# Altium schematic sheet SwitchPower220VAC.SchDoc
size A0
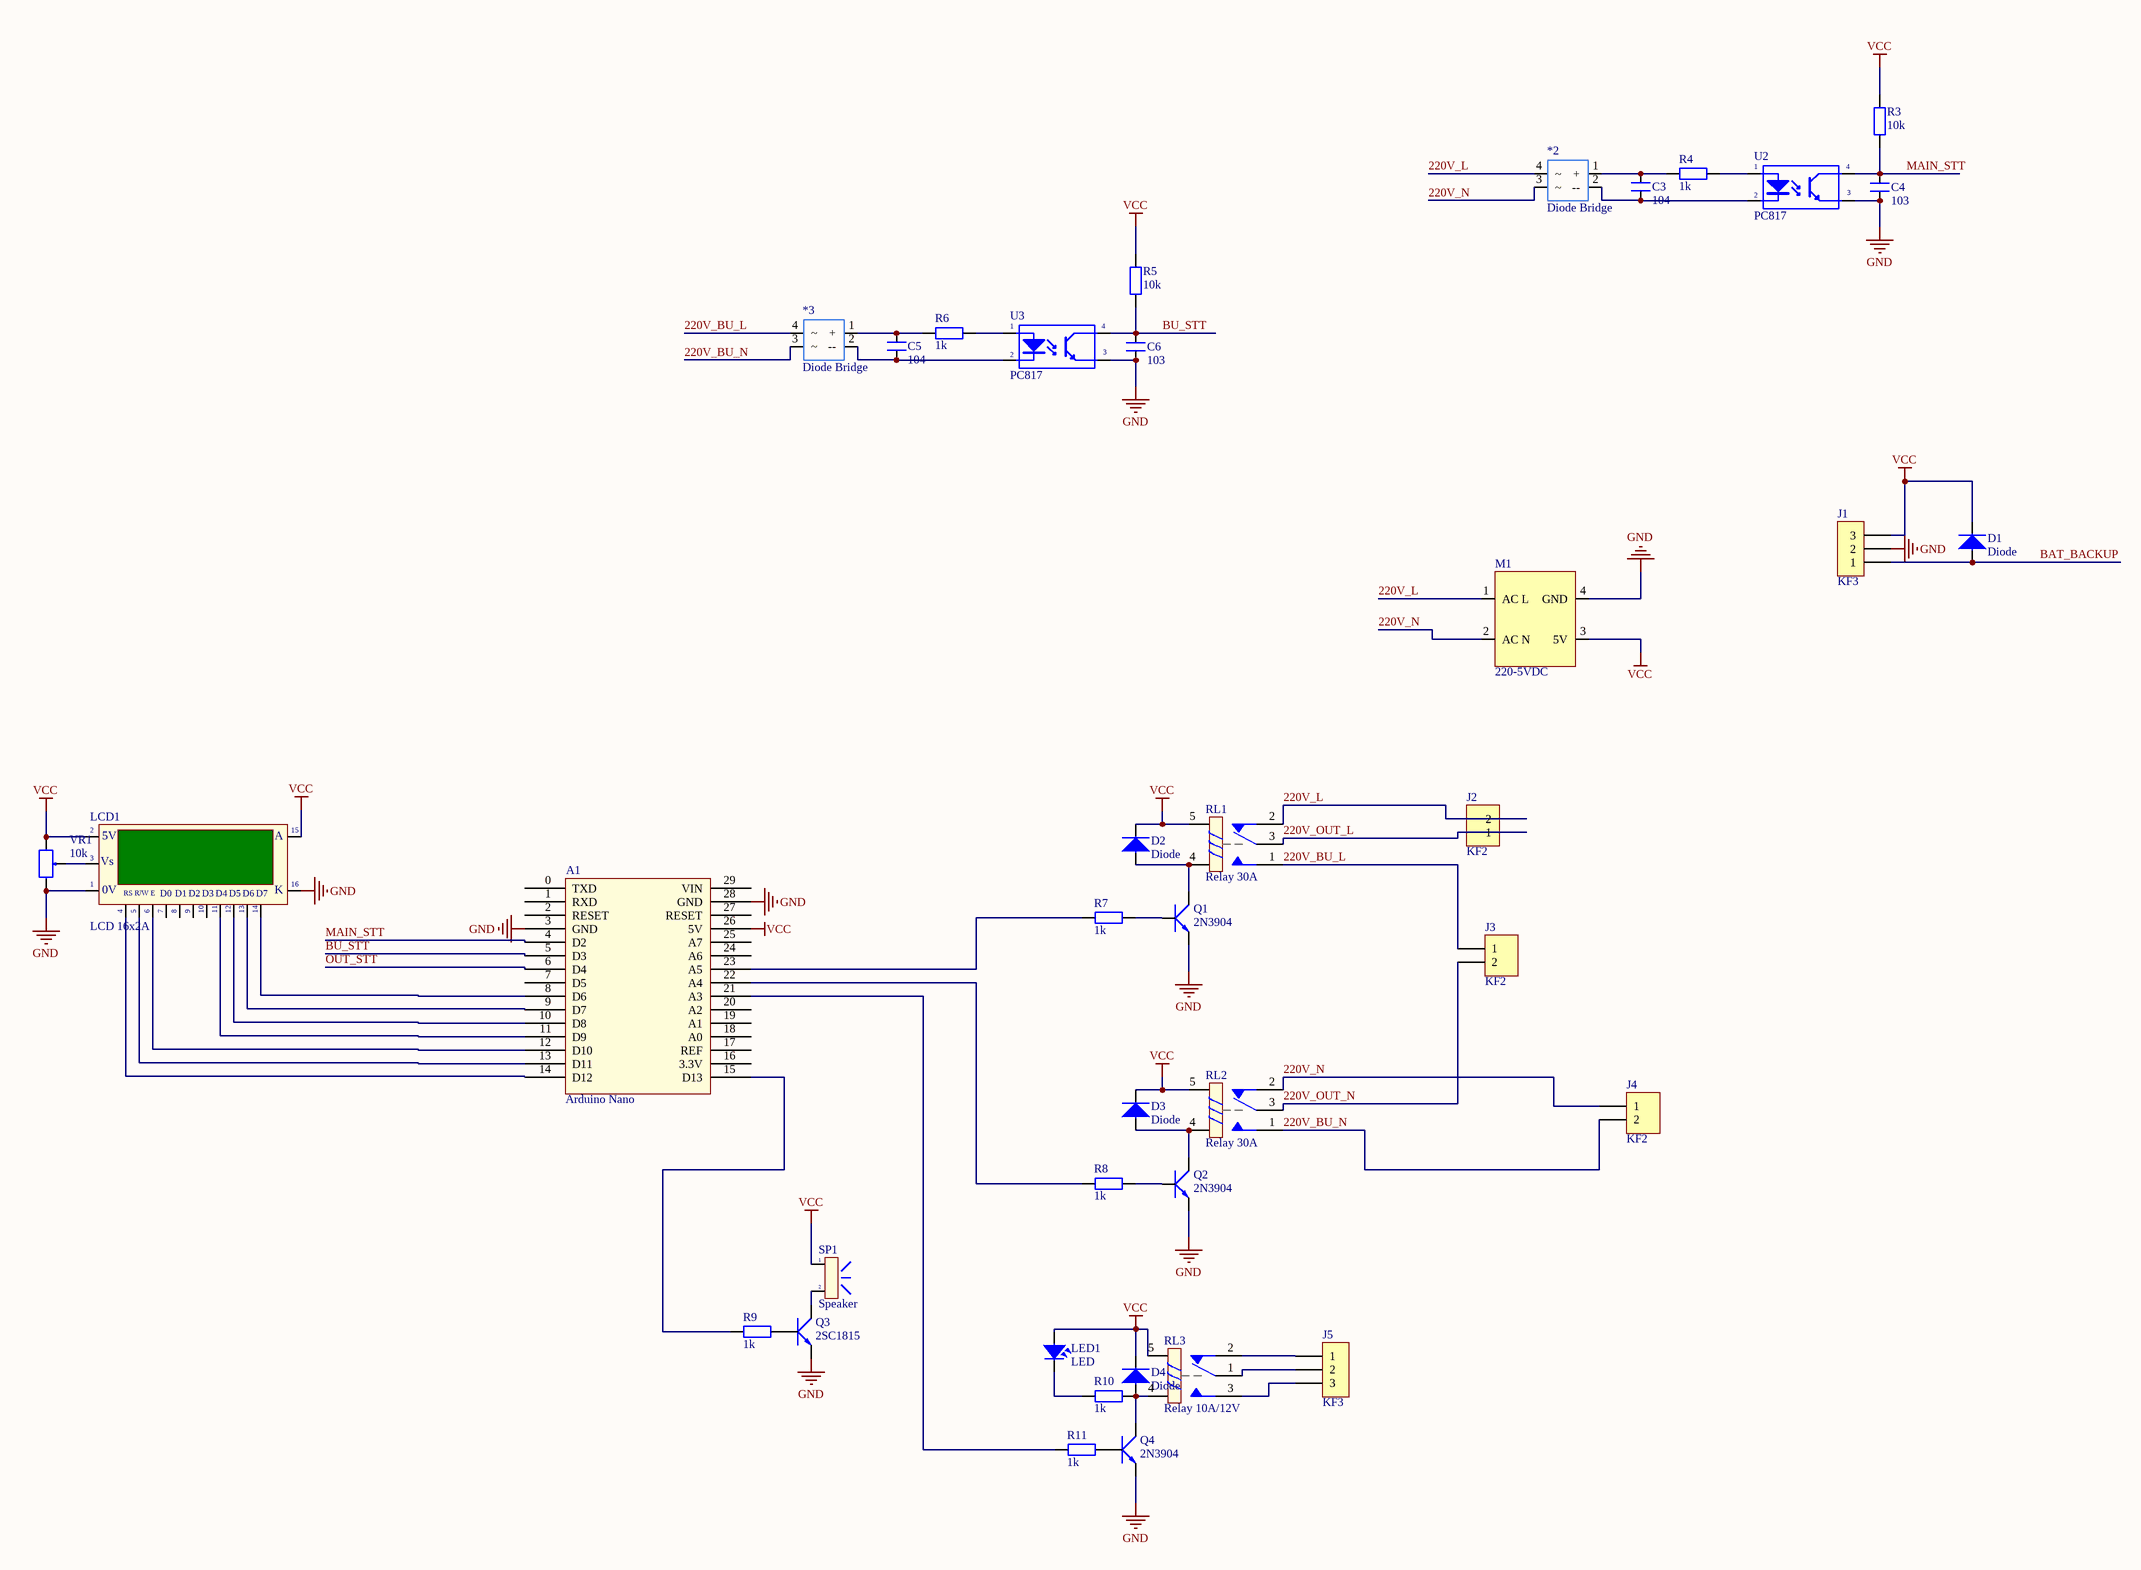
[diagram p0: SwitchPower220VAC.SchDoc]

## Parts
*2  Diode Bridge  [Diode Bridge 1A]
*3  Diode Bridge  [Diode Bridge 1A]
A1  Arduino Nano  [Arduino Nano]
C3  104  [CN2]
C4  103  [SM-0805]
C5  104  [CN2]
C6  103  [SM-0805]
D1  Diode  [DIO-SMD-106]
D2  Diode  [DIO-SMD-106]
D3  Diode  [DIO-SMD-106]
D4  Diode  [DIO-SMD-106]
J1  KF3  [KF3-5.08]
J2  KF2  [KF2-7.62]
J3  KF2  [KF2-7.62]
J4  KF2  [KF2-7.62]
J5  KF3  [KF3-5.08]
LCD1  LCD 16x2A  [LCD16X2]
LED1  LED  [LED-5-Green]
M1  220-5VDC  [5V 700mA 3.5W AC DC]
Q1  2N3904  [TO92-123]
Q2  2N3904  [TO92-123]
Q3  2SC1815  [TO92-123]
Q4  2N3904  [TO92-123]
R3  10k  [RES-SMD-0805]
R4  1k  [RES-SMD-0805]
R5  10k  [RES-SMD-0805]
R6  1k  [RES-SMD-0805]
R7  1k  [RES-SMD-0805]
R8  1k  [RES-SMD-0805]
R9  1k  [RES-SMD-0805]
R10  1k  [RES-SMD-0805]
R11  1k  [RES-SMD-0805]
RL1  Relay 30A  [RELAY 30A]
RL2  Relay 30A  [RELAY 30A]
RL3  Relay 10A/12V  [RL_SPDT_10A]
SP1  Speaker  [SPK]
U2  PC817  [DIP4]
U3  PC817  [DIP4]
VR1  10k  [VR-S2]

## Nets
GND: A1.3(GND) A1.28(GND) C4.1 C6.1 J1.2 LCD1.1(GND) LCD1.16(K) M1.4(GND) Q1.1(E) Q2.1(E) Q3.1(E) Q4.1(E) U2.3(E) U3.3(E) VR1.3
VCC: A1.26(5V) D1.2 D2.2 D3.2 D4.2 J1.3 LCD1.2(VDD) LCD1.15(A) LED1.1 M1.3(5V) R3.2 R5.2 RL1.5 RL2.5 RL3.5 SP1.1 VR1.1
220V_BU_L: *3.4 J3.1 RL1.1
220V_BU_N: *3.3 J4.2 RL2.1
220V_L: *2.4 J2.2 M1.1(AC_L) RL1.2
220V_N: *2.3 J4.1 M1.2(AC_N) RL2.2
220V_OUT_L: J2.1 RL1.3
220V_OUT_N: J3.2 RL2.3
BAT_BACKUP: D1.1 J1.1
BU_STT: A1.5(D3) C6.2 R5.1 U3.4(C)
MAIN_STT: A1.4(D2) C4.2 R3.1 U2.4(C)
OUT_STT: A1.6(D4)
Net*2_1: *2.1(+) C3.2 R4.1
Net*2_2: *2.2(--) C3.1 U2.2(K)
Net*3_1: *3.1(+) C5.2 R6.1
Net*3_2: *3.2(--) C5.1 U3.2(K)
NetA1_8: A1.8(D6) LCD1.14(D7)
NetA1_9: A1.9(D7) LCD1.13(D6)
NetA1_10: A1.10(D8) LCD1.12(D5)
NetA1_11: A1.11(D9) LCD1.11(D4)
NetA1_12: A1.12(D10) LCD1.6(~{EN})
NetA1_13: A1.13(D11) LCD1.5(R/~{W})
NetA1_14: A1.14(D12) LCD1.4(RS)
NetA1_15: A1.15(D13) R9.1
NetA1_21: A1.21(A3) R11.1
NetA1_22: A1.22(A4) R8.1
NetA1_23: A1.23(A5) R7.1
NetD2_1: D2.1 Q1.3(C) RL1.4
NetD3_1: D3.1 Q2.3(C) RL2.4
NetD4_1: D4.1 Q4.3(C) R10.2 RL3.4
NetJ5_1: J5.1 RL3.2
NetJ5_2: J5.2 RL3.1
NetJ5_3: J5.3 RL3.3
NetLCD1_3: LCD1.3(VEE) VR1.2
NetLED1_2: LED1.2 R10.1
NetQ1_2: Q1.2(B) R7.2
NetQ2_2: Q2.2(B) R8.2
NetQ3_2: Q3.2(C) SP1.2
NetQ3_3: Q3.3(B) R9.2
NetQ4_2: Q4.2(B) R11.2
NetR4_2: R4.2 U2.1(A)
NetR6_2: R6.2 U3.1(A)

Not connected (* = marked no-connect by the designer): A1 0(TXD) 1(RXD) 2(RESET) 7(D5) 16(3.3V) 17(REF) 18(A0) 19(A1) 20(A2) 24(A6) 25(A7) 27(RESET) 29(VIN); LCD1 7(D0) 8(D1) 9(D2) 10(D3)

## Notes on the sheet
- (in symbol LCD16x2A) 5V; Vs; |; 0V; R/W; E

## Library data of the parts
C3 C5 = CN2: Cap np 104 => 105pF; Value: 0.1uF
C4 C6 = CM: Cap SMD; Value: 103
J1 J5 = KF3: Manufacturer: Würth Elektronik eiSos GmbH; partNo: 691103110003; ComponentLink1 Description: Manufacturer; ComponentLink2 Description: Datasheet; NoPins: 3; Created Date: 29 October 2013; ComponentLink1URL: http://www.we-online.com; ComponentLink2URL: http://katalog.we-online.de/em/datasheet/6911031100xx.pdf; Created by: Karrer Zheng
J2-J4 = KF2: Manufacturer: Würth Elektronik eiSos GmbH; partNo: 691103110002; ComponentLink1 Description: Manufacturer; ComponentLink2 Description: Datasheet; NoPins: 2; Created Date: 29 October 2013; ComponentLink1URL: http://www.we-online.com; ComponentLink2URL: http://katalog.we-online.de/em/datasheet/6911031100xx.pdf; Created by: Karrer Zheng
LCD1 = LCD16x2A: LCD dipslay 16 char, 2 line; Value: LCD16x2A
M1 = 5V 700mA 3.5W AC 220 to DC
Q1 Q2 Q4 = 2N3904: NPN 600mW, ECB; Value: C1815
Q3 = 2SC1815: NPN 600mW, ECB; Value: C1815
R3-R11 = R: Resistor R1/4W
RL3 = Relay 1: Relay SPDT,10A - 12VDC 5 Pin; Value: Relay SPDT, 10A, 12V
SP1 = SPK: Speaker Chip; Value: Speaker Chip
U2 U3 = PC817: Single Opto; Value: PC817
VR1 = Resistor Var